# Altium schematic sheet Sheet1.SchDoc
size A; SheetNumber: 1; SheetTotal: 2
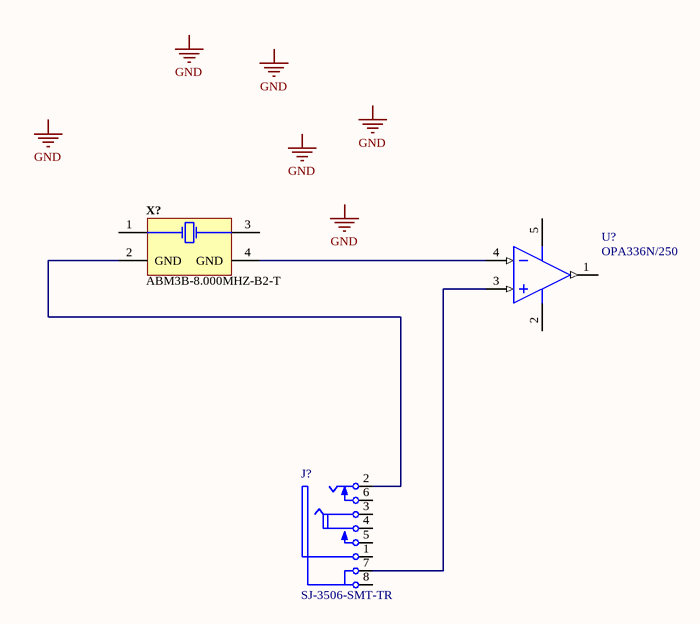
[diagram p0: Sheet1.SchDoc]

## Parts
J?  SJ-3506-SMT-TR  [CUI-SJ-3506-SMT-TR_V]
U?  OPA336N/250  [DBV0005A_M]
X?  ABM3B-8.000MHZ-B2-T  [ABRA-ABM3B_V]

## Nets
NetJ?_2: J?.2(T) X?.2(GND)
NetJ?_7: J?.7(SHLD1) U?.3(IN+)
NetU?_4: U?.4(IN-) X?.4(GND)

Not connected (* = marked no-connect by the designer): J? 1(S) 3(R) 4(IR) 5(RN) 6(TN) 8(SHLD2); U? 1(OUT) 2(V-) 5(V+); X? 1(X1) 3(X2)

## Notes on the sheet
- Labels drawn without touching a wire or pin: GND

## Library data of the parts
J? = CMP-002-00010-2: Female Mid Mount Audio Jack, 6 Position, Height 2.55 mm, Tail Length 2 mm, -25 to 85 degC, RoHS, Tape and Reel; Manufacturer: CUI Inc; Current Rating: 1A; Shielding: Shielded; Max Operating Temperature: 85°C; Connector Type: Audio; Housing Material: Plastic; Datasheet Version: Rev. 1.01, 11/2012; Package Description: Female Mid Mount Audio Jack, 6 Position, Height 2.55 mm, Tail Length 2 mm; Datasheet URL: http://www.cui.com/product/resource/sj-3506-smt.pdf; Gender: Female; Mounting Technology: TH; Min Operating Temperature: -25°C; Contact Material: Brass; Package Reference: SJ-3506-SMT-TR; Case/Package: SJ-3506-SMT-TR; Manufacturer URL: http://www.cui.com/; Package Quantity: 500; Packaging: TapeandReel; RoHS Compliant: True
U? = CMP-014-00020-2: Single-Supply, MicroPower CMOS Operational Amplifier, 2.3 to 5.5 V, -55 to 125 degC, 5-Pin SOT23 (DBV5), Green (RoHS & no Sb/Br), Tape and Reel; Manufacturer: Texas Instruments (TI); Max Supply Voltage: 5V; Unity Gain Bandwidth Product: 100KHz; Slew Rate: 0.03V/us; Nominal Gain Bandwith Product: 11MHz; Common Mode Rejection Ratio: 80dB; Channels: 1; Max I/O Voltage: 125uV; Min Supply Voltage: 3V; Nominal Voltage Gain: 115dB; Nominal Supply Current: 32uA; Package Quantity: 250; Package Reference: DBV0005A; Datasheet URL: http://www.ti.com/general/docs/lit/getliterature.tsp?genericPartNumber=OPA336&fileType=pdf; Package Description: 5-Pin Small Outline Transistor, Body 2.9 x 1.6 mm, Pitch 0.95 mm; Datasheet Version: SBOS068C, 01/2005; Min Operating Temperature: -40°C; Package URL: http://www.ti.com/lit/ml/mpds018l/mpds018l.pdf; RoHS Compliant: True; Case/Package: SOT-23-5; Mounting Technology: SM; Pins: 5; Max Operating Temperature: 85°C; Packaging: TapeandReel; Manufacturer URL: http://www.ti.com/
X? = CMP-003-00021-2: Ceramic SMD Crystal, 8 MHz, +/- 20 ppm, 18 pF, -20 to 70 degC, 4-Pin SMD, RoHS, Tape and Reel; Manufacturer: Abracon; Resistance: 200Ohm; ESR: 200; Tolerance: 20ppm; Frequency: 8MHz; Load Capacitance: 18pF; Mounting Technology: SM; Case/Package: CSMD; Pins: 4; Datasheet Version: Aug-15; Datasheet URL: http://www.abracon.com/Resonators/abm3b.pdf; Manufacturer URL: http://www.abracon.com/; Package Quantity: 1000; Package Description: 4-Pin Surface Mount Device, Body 5 x 3.2 mm; Package Reference: ABM3B; Min Operating Temperature: -20°C; Max Operating Temperature: 70°C; Packaging: TapeandReel; Frequency Tolerance: 20ppm; RoHS Compliant: True